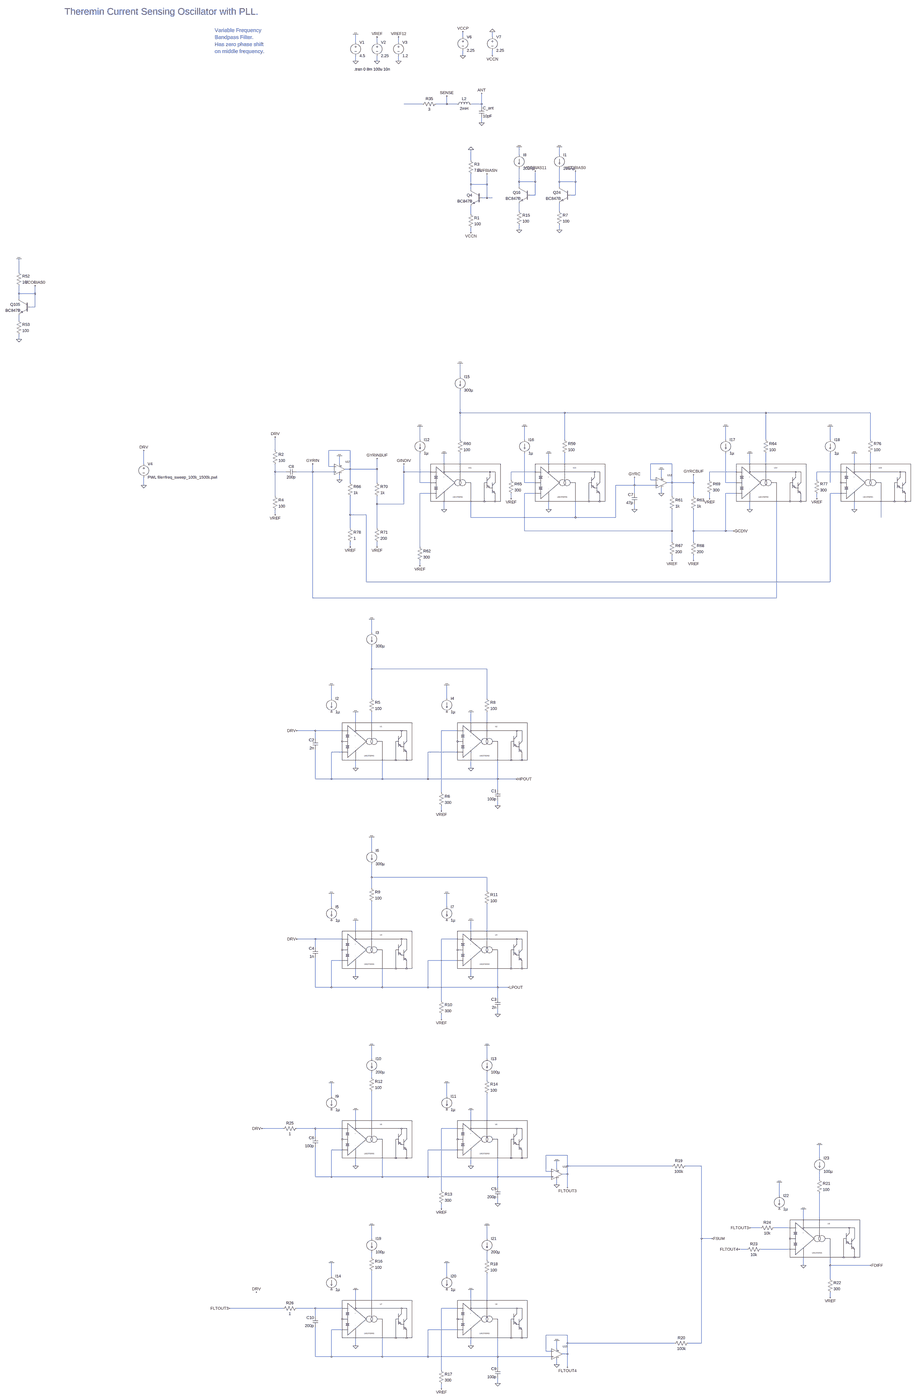
[diagram p0: schematic vco_and_lc_drive_v15.asc, whole sheet]
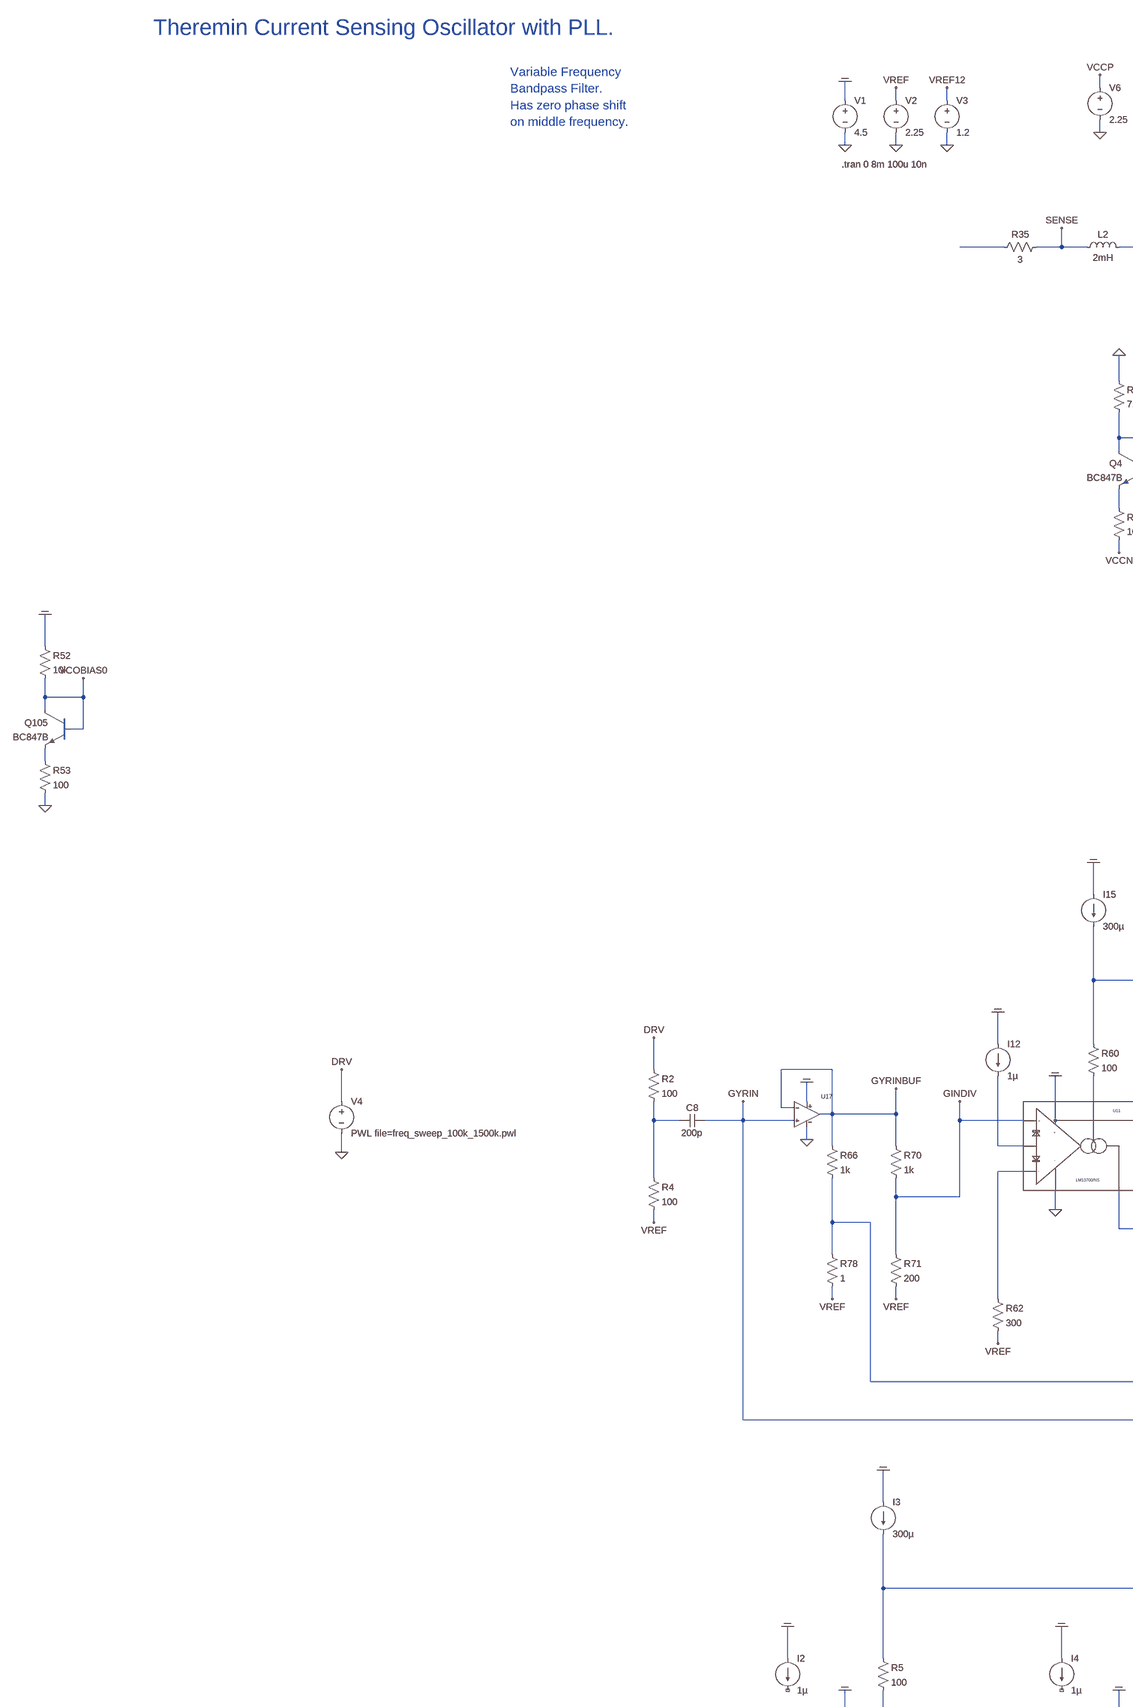
[diagram p1: schematic vco_and_lc_drive_v15.asc, part, row 1 of 2, column 1 of 2]
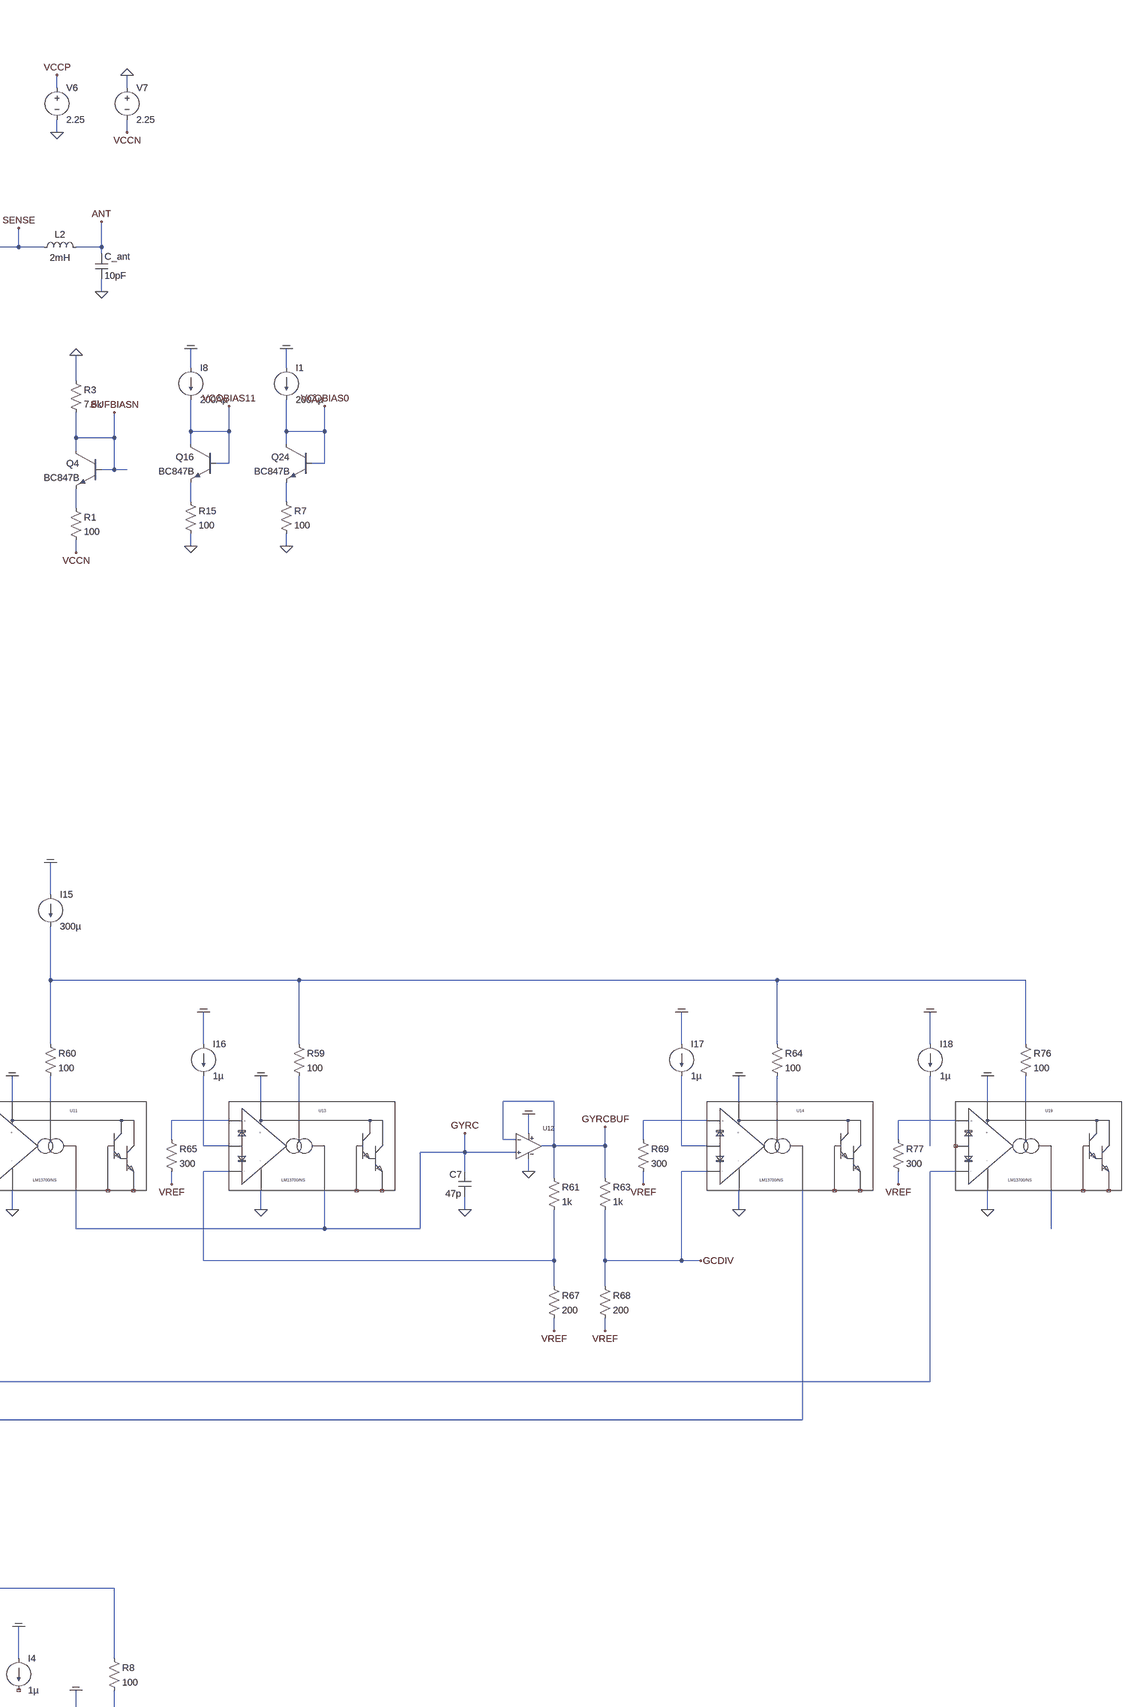
[diagram p2: schematic vco_and_lc_drive_v15.asc, part, row 1 of 2, column 2 of 2]
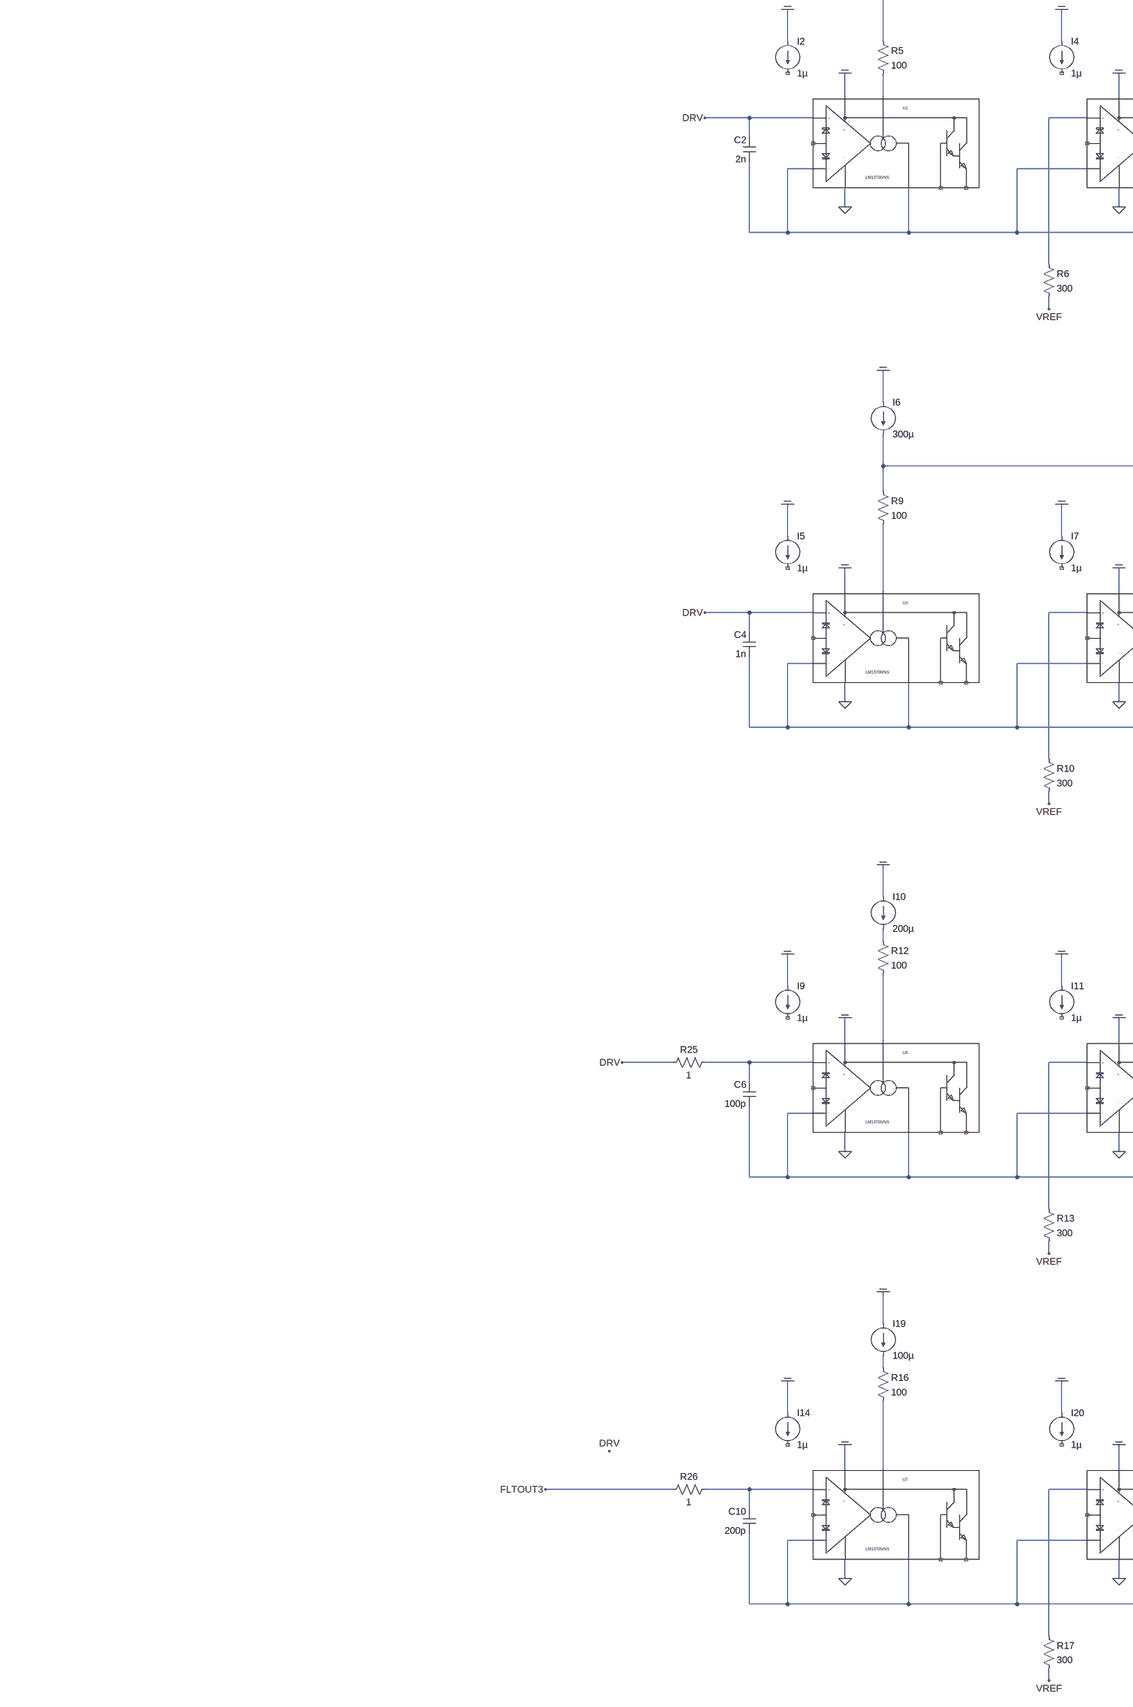
[diagram p3: schematic vco_and_lc_drive_v15.asc, part, row 2 of 2, column 1 of 2]
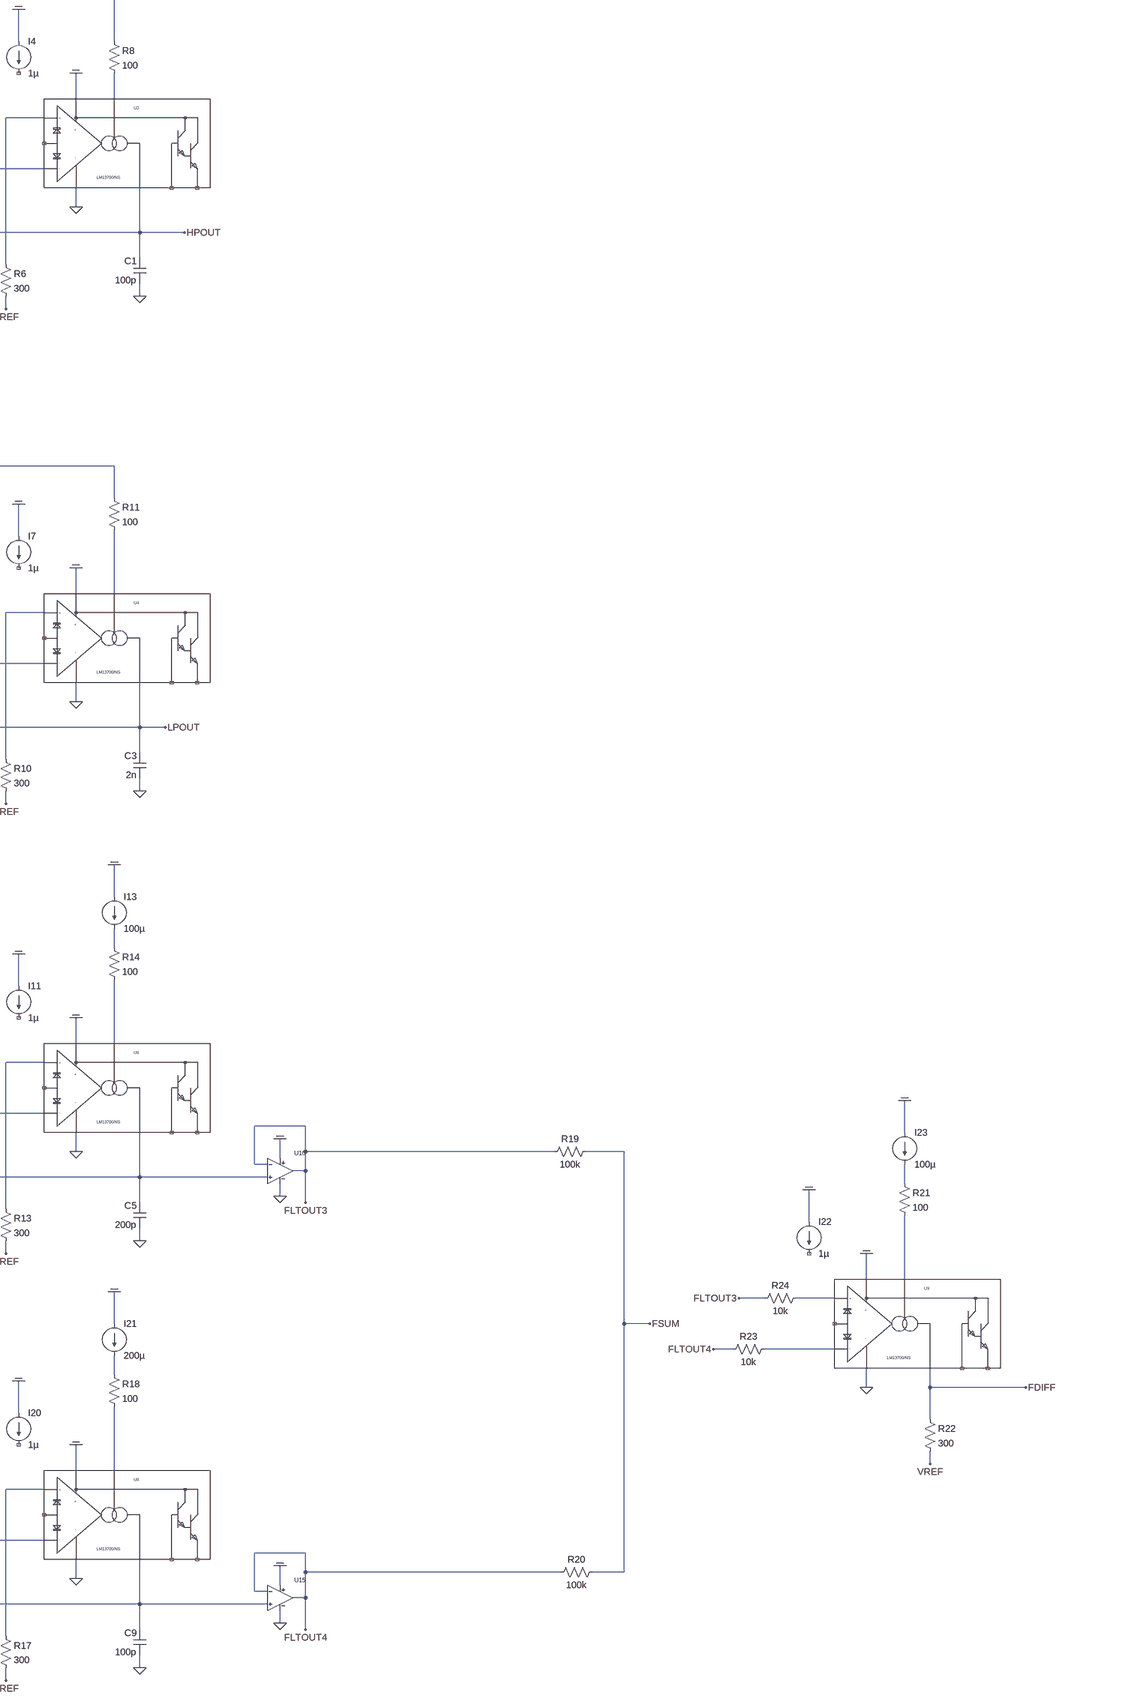
[diagram p4: schematic vco_and_lc_drive_v15.asc, part, row 2 of 2, column 2 of 2]
vco_and_lc_drive_v15.asc, the LTspice schematic file:
Version 4
SHEET 1 13504 29468
WIRE -4960 19040 -4960 19008
WIRE -4784 19040 -4784 19008
WIRE -5600 19072 -5600 19024
WIRE -5472 19072 -5472 19040
WIRE -5344 19072 -5344 19040
WIRE -4960 19152 -4960 19120
WIRE -4784 19152 -4784 19120
WIRE -5600 19184 -5600 19152
WIRE -5472 19184 -5472 19152
WIRE -5344 19184 -5344 19152
WIRE -5200 19440 -5312 19440
WIRE -5056 19440 -5056 19392
WIRE -5056 19440 -5120 19440
WIRE -4992 19440 -5056 19440
WIRE -4848 19440 -4848 19376
WIRE -4848 19440 -4912 19440
WIRE -4848 19456 -4848 19440
WIRE -4848 19552 -4848 19520
WIRE -4624 19856 -4624 19808
WIRE -4384 19856 -4384 19808
WIRE -4912 19888 -4912 19824
WIRE -4624 20016 -4624 19936
WIRE -4528 20016 -4528 19952
WIRE -4528 20016 -4624 20016
WIRE -4384 20016 -4384 19936
WIRE -4288 20016 -4288 19952
WIRE -4288 20016 -4384 20016
WIRE -4912 20032 -4912 19968
WIRE -4816 20032 -4816 19968
WIRE -4816 20032 -4912 20032
WIRE -4624 20048 -4624 20016
WIRE -4384 20048 -4384 20016
WIRE -4912 20064 -4912 20032
WIRE -4528 20096 -4528 20016
WIRE -4528 20096 -4560 20096
WIRE -4288 20096 -4288 20016
WIRE -4288 20096 -4320 20096
WIRE -4816 20112 -4816 20032
WIRE -4816 20112 -4848 20112
WIRE -4784 20112 -4816 20112
WIRE -4624 20192 -4624 20144
WIRE -4384 20192 -4384 20144
WIRE -4912 20208 -4912 20160
WIRE -4624 20304 -4624 20272
WIRE -4384 20304 -4384 20272
WIRE -4912 20320 -4912 20288
WIRE -7904 20928 -7904 20848
WIRE -7904 21056 -7904 21008
WIRE -7808 21056 -7808 21008
WIRE -7808 21056 -7904 21056
WIRE -7904 21088 -7904 21056
WIRE -7808 21136 -7808 21056
WIRE -7808 21136 -7840 21136
WIRE -7904 21216 -7904 21184
WIRE -7904 21328 -7904 21296
WIRE -4976 21632 -4976 21552
WIRE -4976 21872 -4976 21712
WIRE -4352 21872 -4976 21872
WIRE -3152 21872 -4352 21872
WIRE -2528 21872 -3152 21872
WIRE -5216 22032 -5216 21952
WIRE -4976 22032 -4976 21872
WIRE -4592 22032 -4592 21952
WIRE -4352 22032 -4352 21872
WIRE -3392 22032 -3392 21952
WIRE -3152 22032 -3152 21872
WIRE -2768 22032 -2768 21952
WIRE -2528 22032 -2528 21872
WIRE -6080 22096 -6080 22016
WIRE -5632 22096 -5760 22096
WIRE -6864 22176 -6864 22096
WIRE -5696 22176 -5696 22128
WIRE -5072 22176 -5072 22112
WIRE -4976 22176 -4976 22112
WIRE -4448 22176 -4448 22112
WIRE -4352 22176 -4352 22112
WIRE -3712 22176 -3840 22176
WIRE -3248 22176 -3248 22112
WIRE -3152 22176 -3152 22112
WIRE -2624 22176 -2624 22112
WIRE -2528 22176 -2528 22112
WIRE -5760 22192 -5760 22096
WIRE -5728 22192 -5760 22192
WIRE -5632 22208 -5632 22096
WIRE -5632 22208 -5664 22208
WIRE -5472 22208 -5472 22144
WIRE -5472 22208 -5632 22208
WIRE -6080 22224 -6080 22176
WIRE -6016 22224 -6080 22224
WIRE -5856 22224 -5856 22176
WIRE -5856 22224 -5952 22224
WIRE -5728 22224 -5856 22224
WIRE -5312 22224 -5312 22176
WIRE -5152 22224 -5312 22224
WIRE -4528 22224 -4672 22224
WIRE -3328 22224 -3488 22224
WIRE -2704 22224 -2848 22224
WIRE -3776 22256 -3776 22208
WIRE -5696 22272 -5696 22240
WIRE -4672 22272 -4672 22224
WIRE -3840 22272 -3840 22176
WIRE -3808 22272 -3840 22272
WIRE -3488 22272 -3488 22224
WIRE -2848 22272 -2848 22224
WIRE -5632 22288 -5632 22208
WIRE -5472 22288 -5472 22208
WIRE -5216 22288 -5216 22112
WIRE -5152 22288 -5216 22288
WIRE -4592 22288 -4592 22112
WIRE -4528 22288 -4592 22288
WIRE -3712 22288 -3712 22176
WIRE -3712 22288 -3744 22288
WIRE -3584 22288 -3584 22240
WIRE -3584 22288 -3712 22288
WIRE -3392 22288 -3392 22112
WIRE -3328 22288 -3392 22288
WIRE -2768 22288 -2768 22112
WIRE -6864 22304 -6864 22256
WIRE -3936 22304 -3936 22256
WIRE -3936 22304 -4048 22304
WIRE -3808 22304 -3936 22304
WIRE -5152 22352 -5216 22352
WIRE -4528 22352 -4592 22352
WIRE -3936 22352 -3936 22304
WIRE -3776 22352 -3776 22320
WIRE -3328 22352 -3392 22352
WIRE -2704 22352 -2768 22352
WIRE -6080 22368 -6080 22224
WIRE -3712 22368 -3712 22288
WIRE -3584 22368 -3584 22288
WIRE -4672 22384 -4672 22352
WIRE -3488 22384 -3488 22352
WIRE -2848 22384 -2848 22352
WIRE -5472 22416 -5472 22368
WIRE -5312 22416 -5312 22224
WIRE -5312 22416 -5472 22416
WIRE -5072 22448 -5072 22400
WIRE -4448 22448 -4448 22400
WIRE -3936 22448 -3936 22416
WIRE -3248 22448 -3248 22400
WIRE -2624 22448 -2624 22400
WIRE -6080 22480 -6080 22448
WIRE -5632 22480 -5632 22368
WIRE -5536 22480 -5632 22480
WIRE -4912 22496 -4912 22400
WIRE -4288 22496 -4288 22400
WIRE -4288 22496 -4912 22496
WIRE -4048 22496 -4048 22304
WIRE -4048 22496 -4288 22496
WIRE -2464 22496 -2464 22400
WIRE -5632 22560 -5632 22480
WIRE -5472 22560 -5472 22416
WIRE -4592 22576 -4592 22352
WIRE -3712 22576 -3712 22448
WIRE -3712 22576 -4592 22576
WIRE -3584 22576 -3584 22448
WIRE -3392 22576 -3392 22352
WIRE -3392 22576 -3584 22576
WIRE -3344 22576 -3392 22576
WIRE -3712 22640 -3712 22576
WIRE -3584 22640 -3584 22576
WIRE -5632 22672 -5632 22640
WIRE -5472 22672 -5472 22640
WIRE -5216 22672 -5216 22352
WIRE -3712 22752 -3712 22720
WIRE -3584 22752 -3584 22720
WIRE -5216 22784 -5216 22752
WIRE -5536 22880 -5536 22480
WIRE -2768 22880 -2768 22352
WIRE -2768 22880 -5536 22880
WIRE -5856 22976 -5856 22224
WIRE -3088 22976 -3088 22400
WIRE -3088 22976 -5856 22976
WIRE -5504 23888 -5504 23808
WIRE -5504 24112 -5504 23968
WIRE -4816 24112 -5504 24112
WIRE -5744 24288 -5744 24208
WIRE -5504 24288 -5504 24112
WIRE -5056 24288 -5056 24208
WIRE -4816 24288 -4816 24112
WIRE -5600 24432 -5600 24368
WIRE -5504 24432 -5504 24368
WIRE -4912 24432 -4912 24368
WIRE -4816 24432 -4816 24368
WIRE -5840 24480 -5952 24480
WIRE -5680 24480 -5840 24480
WIRE -4992 24480 -5088 24480
WIRE -5840 24528 -5840 24480
WIRE -5680 24608 -5744 24608
WIRE -4992 24608 -5168 24608
WIRE -5600 24704 -5600 24656
WIRE -4912 24704 -4912 24656
WIRE -5840 24768 -5840 24592
WIRE -5744 24768 -5744 24608
WIRE -5744 24768 -5840 24768
WIRE -5440 24768 -5440 24656
WIRE -5440 24768 -5744 24768
WIRE -5168 24768 -5168 24608
WIRE -5168 24768 -5440 24768
WIRE -4752 24768 -4752 24656
WIRE -4752 24768 -5168 24768
WIRE -4640 24768 -4752 24768
WIRE -4752 24832 -4752 24768
WIRE -5088 24848 -5088 24480
WIRE -4752 24928 -4752 24896
WIRE -5088 24960 -5088 24928
WIRE -5504 25200 -5504 25120
WIRE -5504 25360 -5504 25280
WIRE -4816 25360 -5504 25360
WIRE -5504 25424 -5504 25360
WIRE -4816 25440 -4816 25360
WIRE -5744 25536 -5744 25456
WIRE -5056 25536 -5056 25456
WIRE -5600 25680 -5600 25616
WIRE -5504 25680 -5504 25504
WIRE -4912 25680 -4912 25616
WIRE -4816 25680 -4816 25520
WIRE -5840 25728 -5952 25728
WIRE -5680 25728 -5840 25728
WIRE -4992 25728 -5088 25728
WIRE -5840 25776 -5840 25728
WIRE -5680 25856 -5744 25856
WIRE -4992 25856 -5168 25856
WIRE -5600 25952 -5600 25904
WIRE -4912 25952 -4912 25904
WIRE -5840 26016 -5840 25840
WIRE -5744 26016 -5744 25856
WIRE -5744 26016 -5840 26016
WIRE -5440 26016 -5440 25904
WIRE -5440 26016 -5744 26016
WIRE -5168 26016 -5168 25856
WIRE -5168 26016 -5440 26016
WIRE -4752 26016 -4752 25904
WIRE -4752 26016 -5168 26016
WIRE -4688 26016 -4752 26016
WIRE -4752 26080 -4752 26016
WIRE -5088 26096 -5088 25728
WIRE -4752 26176 -4752 26144
WIRE -5088 26208 -5088 26176
WIRE -5504 26624 -5504 26544
WIRE -4816 26624 -4816 26544
WIRE -5504 26736 -5504 26704
WIRE -4816 26752 -4816 26704
WIRE -5744 26848 -5744 26768
WIRE -5056 26848 -5056 26768
WIRE -5600 26992 -5600 26928
WIRE -5504 26992 -5504 26816
WIRE -4912 26992 -4912 26928
WIRE -4816 26992 -4816 26832
WIRE -6032 27040 -6160 27040
WIRE -5840 27040 -5952 27040
WIRE -5680 27040 -5840 27040
WIRE -4992 27040 -5088 27040
WIRE -5840 27088 -5840 27040
WIRE -5680 27168 -5744 27168
WIRE -4992 27168 -5168 27168
WIRE -4336 27200 -4464 27200
WIRE -2832 27216 -2832 27136
WIRE -5600 27264 -5600 27216
WIRE -4912 27264 -4912 27216
WIRE -4336 27264 -4336 27200
WIRE -3712 27264 -4336 27264
WIRE -3536 27264 -3632 27264
WIRE -4400 27280 -4400 27232
WIRE -4464 27296 -4464 27200
WIRE -4432 27296 -4464 27296
WIRE -4336 27312 -4336 27264
WIRE -4336 27312 -4368 27312
WIRE -5840 27328 -5840 27152
WIRE -5744 27328 -5744 27168
WIRE -5744 27328 -5840 27328
WIRE -5440 27328 -5440 27216
WIRE -5440 27328 -5744 27328
WIRE -5168 27328 -5168 27168
WIRE -5168 27328 -5440 27328
WIRE -4752 27328 -4752 27216
WIRE -4752 27328 -5168 27328
WIRE -4432 27328 -4752 27328
WIRE -2832 27344 -2832 27296
WIRE -4400 27376 -4400 27344
WIRE -4752 27392 -4752 27328
WIRE -4336 27392 -4336 27312
WIRE -5088 27408 -5088 27040
WIRE -3072 27440 -3072 27360
WIRE -4752 27488 -4752 27456
WIRE -5088 27520 -5088 27488
WIRE -2928 27584 -2928 27520
WIRE -2832 27584 -2832 27424
WIRE -3184 27632 -3248 27632
WIRE -3008 27632 -3104 27632
WIRE -5504 27696 -5504 27616
WIRE -4816 27696 -4816 27616
WIRE -3536 27696 -3536 27264
WIRE -3472 27696 -3536 27696
WIRE -3264 27760 -3312 27760
WIRE -3008 27760 -3184 27760
WIRE -5504 27808 -5504 27776
WIRE -4816 27824 -4816 27776
WIRE -2928 27856 -2928 27808
WIRE -2768 27856 -2768 27808
WIRE -2528 27856 -2768 27856
WIRE -5744 27920 -5744 27840
WIRE -5056 27920 -5056 27840
WIRE -2768 27936 -2768 27856
WIRE -2768 28048 -2768 28016
WIRE -5600 28064 -5600 28000
WIRE -5504 28064 -5504 27888
WIRE -4912 28064 -4912 28000
WIRE -4816 28064 -4816 27904
WIRE -6032 28112 -6352 28112
WIRE -5840 28112 -5952 28112
WIRE -5680 28112 -5840 28112
WIRE -4992 28112 -5088 28112
WIRE -5840 28160 -5840 28112
WIRE -5680 28240 -5744 28240
WIRE -4992 28240 -5168 28240
WIRE -4336 28272 -4464 28272
WIRE -4336 28320 -4336 28272
WIRE -3696 28320 -4336 28320
WIRE -3536 28320 -3536 27696
WIRE -3536 28320 -3616 28320
WIRE -5600 28336 -5600 28288
WIRE -4912 28336 -4912 28288
WIRE -4400 28352 -4400 28304
WIRE -4464 28368 -4464 28272
WIRE -4432 28368 -4464 28368
WIRE -4336 28384 -4336 28320
WIRE -4336 28384 -4368 28384
WIRE -5840 28400 -5840 28224
WIRE -5744 28400 -5744 28240
WIRE -5744 28400 -5840 28400
WIRE -5440 28400 -5440 28288
WIRE -5440 28400 -5744 28400
WIRE -5168 28400 -5168 28240
WIRE -5168 28400 -5440 28400
WIRE -4752 28400 -4752 28288
WIRE -4752 28400 -5168 28400
WIRE -4432 28400 -4752 28400
WIRE -4400 28448 -4400 28416
WIRE -4752 28464 -4752 28400
WIRE -4336 28464 -4336 28384
WIRE -5088 28480 -5088 28112
WIRE -4752 28560 -4752 28528
WIRE -5088 28592 -5088 28560
FLAG -5600 19184 0
FLAG -5600 19024 COM
FLAG -5472 19184 0
FLAG -5472 19040 VREF
FLAG -4848 19376 ANT
FLAG -5056 19392 SENSE
FLAG -5344 19184 0
FLAG -5344 19040 VREF12
FLAG -7904 20848 COM
FLAG -7904 21328 0
FLAG -7808 21008 VCOBIAS0
FLAG -4960 19152 0
FLAG -4960 19008 VCCP
FLAG -4784 19008 0
FLAG -4784 19152 VCCN
FLAG -4912 20320 VCCN
FLAG -4912 19824 0
FLAG -4816 19968 BUFBIASN
FLAG -4848 19552 0
FLAG -4624 20304 0
FLAG -4528 19952 VCOBIAS11
FLAG -4624 19808 COM
FLAG -4384 20304 0
FLAG -4288 19952 VCOBIAS0
FLAG -4384 19808 COM
FLAG -6864 22304 0
FLAG -6864 22096 DRV
FLAG -5072 22448 0
FLAG -5072 22112 COM
FLAG -5216 21952 COM
FLAG -3936 22448 0
FLAG -3936 22256 GYRC
FLAG -4976 21552 COM
FLAG -5216 22784 VREF
FLAG -3776 22352 0
FLAG -3776 22208 COM
FLAG -4448 22448 0
FLAG -4448 22112 COM
FLAG -4592 21952 COM
FLAG -4672 22384 VREF
FLAG -3712 22752 VREF
FLAG -6080 22016 DRV
FLAG -3248 22448 0
FLAG -3248 22112 COM
FLAG -3392 21952 COM
FLAG -3488 22384 VREF
FLAG -5696 22272 0
FLAG -5696 22128 COM
FLAG -2624 22448 0
FLAG -2624 22112 COM
FLAG -2768 21952 COM
FLAG -2848 22384 VREF
FLAG -5632 22672 VREF
FLAG -3584 22752 VREF
FLAG -5472 22672 VREF
FLAG -5856 22176 GYRIN
FLAG -5472 22144 GYRINBUF
FLAG -3584 22240 GYRCBUF
FLAG -3344 22576 GCDIV
FLAG -5312 22176 GINDIV
FLAG -6080 22480 VREF
FLAG -5600 24704 0
FLAG -5600 24368 COM
FLAG -5744 24208 COM
FLAG -5504 23808 COM
FLAG -5088 24960 VREF
FLAG -5952 24480 DRV
FLAG -4912 24704 0
FLAG -4912 24368 COM
FLAG -5056 24208 COM
FLAG -4752 24928 0
FLAG -5600 25952 0
FLAG -5600 25616 COM
FLAG -5744 25456 COM
FLAG -5504 25120 COM
FLAG -5088 26208 VREF
FLAG -5952 25728 DRV
FLAG -4912 25952 0
FLAG -4912 25616 COM
FLAG -5056 25456 COM
FLAG -4752 26176 0
FLAG -4688 26016 LPOUT
FLAG -4640 24768 HPOUT
FLAG -5600 27264 0
FLAG -5600 26928 COM
FLAG -5744 26768 COM
FLAG -5504 26544 COM
FLAG -5088 27520 VREF
FLAG -6160 27040 DRV
FLAG -4912 27264 0
FLAG -4912 26928 COM
FLAG -5056 26768 COM
FLAG -4752 27488 0
FLAG -4336 27392 FLTOUT3
FLAG -4816 26544 COM
FLAG -5600 28336 0
FLAG -5600 28000 COM
FLAG -5744 27840 COM
FLAG -5504 27616 COM
FLAG -5088 28592 VREF
FLAG -6192 28016 DRV
FLAG -4912 28336 0
FLAG -4912 28000 COM
FLAG -5056 27840 COM
FLAG -4752 28560 0
FLAG -4336 28464 FLTOUT4
FLAG -4816 27616 COM
FLAG -3472 27696 FSUM
FLAG -2928 27856 0
FLAG -2928 27520 COM
FLAG -3072 27360 COM
FLAG -2832 27136 COM
FLAG -2768 28048 VREF
FLAG -3312 27760 FLTOUT4
FLAG -3248 27632 FLTOUT3
FLAG -2528 27856 FDIFF
FLAG -4400 27376 0
FLAG -4400 27232 COM
FLAG -4400 28448 0
FLAG -4400 28304 COM
FLAG -6352 28112 FLTOUT3
SYMBOL voltage -5600 19056 R0
SYMATTR InstName V1
SYMATTR Value 4.5
SYMBOL Voltage -5472 19056 R0
SYMATTR InstName V2
SYMATTR Value 2.25
SYMBOL ind -5008 19456 R270
WINDOW 0 32 56 VTop 2
WINDOW 3 5 56 VBottom 2
SYMATTR InstName L2
SYMATTR Value 2mH
SYMATTR SpiceLine Rser=120 Cpar=1pF
SYMBOL Cap -4864 19456 R0
SYMATTR InstName C_ant
SYMATTR Value 10pF
SYMBOL Res -5216 19456 R270
WINDOW 0 32 56 VTop 2
WINDOW 3 0 56 VBottom 2
SYMATTR InstName R35
SYMATTR Value 3
SYMBOL Voltage -5344 19056 R0
SYMATTR InstName V3
SYMATTR Value 1.2
SYMBOL npn -7840 21088 M0
SYMATTR InstName Q105
SYMATTR Value BC847B
SYMBOL Res -7920 20912 R0
SYMATTR InstName R52
SYMATTR Value 10k
SYMBOL Res -7920 21200 R0
SYMATTR InstName R53
SYMATTR Value 100
SYMBOL Voltage -4960 19024 R0
SYMATTR InstName V6
SYMATTR Value 2.25
SYMBOL Voltage -4784 19024 R0
SYMATTR InstName V7
SYMATTR Value 2.25
SYMBOL npn -4848 20064 M0
SYMATTR InstName Q4
SYMATTR Value BC847B
SYMBOL Res -4928 20192 R0
SYMATTR InstName R1
SYMATTR Value 100
SYMBOL Res -4928 19872 R0
SYMATTR InstName R3
SYMATTR Value 7.5k
SYMBOL npn -4560 20048 M0
SYMATTR InstName Q16
SYMATTR Value BC847B
SYMBOL Res -4640 20176 R0
SYMATTR InstName R15
SYMATTR Value 100
SYMBOL current -4624 19856 R0
SYMATTR InstName I8
SYMATTR Value 200Âµ
SYMBOL npn -4320 20048 M0
SYMATTR InstName Q24
SYMATTR Value BC847B
SYMBOL Res -4400 20176 R0
SYMATTR InstName R7
SYMATTR Value 100
SYMBOL current -4384 19856 R0
SYMATTR InstName I1
SYMATTR Value 200Âµ
SYMBOL Voltage -6864 22160 R0
SYMATTR InstName V4
SYMATTR Value PWL file=freq_sweep_100k_1500k.pwl
SYMBOL LM13700 -5072 22288 R0
SYMATTR InstName U11
SYMBOL current -5216 22032 R0
SYMATTR InstName I12
SYMATTR Value 1µ
SYMBOL Cap -3920 22416 R180
WINDOW 0 24 56 Left 2
WINDOW 3 24 8 Left 2
SYMATTR InstName C7
SYMATTR Value 47p
SYMBOL Res -4992 22016 R0
SYMATTR InstName R60
SYMATTR Value 100
SYMBOL Res -3728 22352 R0
SYMATTR InstName R61
SYMATTR Value 1k
SYMBOL current -4976 21632 R0
SYMATTR InstName I15
SYMATTR Value 300µ
SYMBOL Res -5232 22656 R0
SYMATTR InstName R62
SYMATTR Value 300
SYMBOL MCP6021 -3776 22288 R0
SYMATTR InstName U12
SYMBOL LM13700 -4448 22288 R0
SYMATTR InstName U13
SYMBOL current -4592 22032 R0
SYMATTR InstName I16
SYMATTR Value 1µ
SYMBOL Res -4368 22016 R0
SYMATTR InstName R59
SYMATTR Value 100
SYMBOL Res -4688 22256 R0
SYMATTR InstName R65
SYMATTR Value 300
SYMBOL Res -3728 22624 R0
SYMATTR InstName R67
SYMATTR Value 200
SYMBOL LM13700 -3248 22288 R0
SYMATTR InstName U14
SYMBOL current -3392 22032 R0
SYMATTR InstName I17
SYMATTR Value 1µ
SYMBOL Res -3168 22016 R0
SYMATTR InstName R64
SYMATTR Value 100
SYMBOL Res -5648 22272 R0
SYMATTR InstName R66
SYMATTR Value 1k
SYMBOL Res -3504 22256 R0
SYMATTR InstName R69
SYMATTR Value 300
SYMBOL MCP6021 -5696 22208 R0
SYMATTR InstName U17
SYMBOL LM13700 -2624 22288 R0
SYMATTR InstName U19
SYMBOL current -2768 22032 R0
SYMATTR InstName I18
SYMATTR Value 1µ
SYMBOL Res -2544 22016 R0
SYMATTR InstName R76
SYMATTR Value 100
SYMBOL Res -2864 22256 R0
SYMATTR InstName R77
SYMATTR Value 300
SYMBOL Res -5648 22544 R0
SYMATTR InstName R78
SYMATTR Value 1
SYMBOL Res -3600 22352 R0
SYMATTR InstName R63
SYMATTR Value 1k
SYMBOL Res -3600 22624 R0
SYMATTR InstName R68
SYMATTR Value 200
SYMBOL Res -5488 22272 R0
SYMATTR InstName R70
SYMATTR Value 1k
SYMBOL Res -5488 22544 R0
SYMATTR InstName R71
SYMATTR Value 200
SYMBOL Cap -5952 22208 R90
WINDOW 0 0 32 VBottom 2
WINDOW 3 32 32 VTop 2
SYMATTR InstName C8
SYMATTR Value 200p
SYMBOL Res -6096 22080 R0
SYMATTR InstName R2
SYMATTR Value 100
SYMBOL Res -6096 22352 R0
SYMATTR InstName R4
SYMATTR Value 100
SYMBOL LM13700 -5600 24544 R0
SYMATTR InstName U1
SYMBOL current -5744 24288 R0
SYMATTR InstName I2
SYMATTR Value 1µ
SYMBOL Res -5520 24272 R0
SYMATTR InstName R5
SYMATTR Value 100
SYMBOL current -5504 23888 R0
SYMATTR InstName I3
SYMATTR Value 300µ
SYMBOL Res -5104 24832 R0
SYMATTR InstName R6
SYMATTR Value 300
SYMBOL LM13700 -4912 24544 R0
SYMATTR InstName U2
SYMBOL current -5056 24288 R0
SYMATTR InstName I4
SYMATTR Value 1µ
SYMBOL Res -4832 24272 R0
SYMATTR InstName R8
SYMATTR Value 100
SYMBOL Cap -4736 24896 R180
WINDOW 0 24 56 Left 2
WINDOW 3 24 8 Left 2
SYMATTR InstName C1
SYMATTR Value 100p
SYMBOL Cap -5824 24592 R180
WINDOW 0 24 56 Left 2
WINDOW 3 24 8 Left 2
SYMATTR InstName C2
SYMATTR Value 2n
SYMBOL LM13700 -5600 25792 R0
SYMATTR InstName U3
SYMBOL current -5744 25536 R0
SYMATTR InstName I5
SYMATTR Value 1µ
SYMBOL Res -5520 25408 R0
SYMATTR InstName R9
SYMATTR Value 100
SYMBOL current -5504 25200 R0
SYMATTR InstName I6
SYMATTR Value 300µ
SYMBOL Res -5104 26080 R0
SYMATTR InstName R10
SYMATTR Value 300
SYMBOL LM13700 -4912 25792 R0
SYMATTR InstName U4
SYMBOL current -5056 25536 R0
SYMATTR InstName I7
SYMATTR Value 1µ
SYMBOL Res -4832 25424 R0
SYMATTR InstName R11
SYMATTR Value 100
SYMBOL Cap -4736 26144 R180
WINDOW 0 24 56 Left 2
WINDOW 3 24 8 Left 2
SYMATTR InstName C3
SYMATTR Value 2n
SYMBOL Cap -5824 25840 R180
WINDOW 0 24 56 Left 2
WINDOW 3 24 8 Left 2
SYMATTR InstName C4
SYMATTR Value 1n
SYMBOL LM13700 -5600 27104 R0
SYMATTR InstName U5
SYMBOL current -5744 26848 R0
SYMATTR InstName I9
SYMATTR Value 1µ
SYMBOL Res -5520 26720 R0
SYMATTR InstName R12
SYMATTR Value 100
SYMBOL current -5504 26624 R0
SYMATTR InstName I10
SYMATTR Value 200µ
SYMBOL Res -5104 27392 R0
SYMATTR InstName R13
SYMATTR Value 300
SYMBOL LM13700 -4912 27104 R0
SYMATTR InstName U6
SYMBOL current -5056 26848 R0
SYMATTR InstName I11
SYMATTR Value 1µ
SYMBOL Res -4832 26736 R0
SYMATTR InstName R14
SYMATTR Value 100
SYMBOL Cap -4736 27456 R180
WINDOW 0 24 56 Left 2
WINDOW 3 24 8 Left 2
SYMATTR InstName C5
SYMATTR Value 200p
SYMBOL Cap -5824 27152 R180
WINDOW 0 24 56 Left 2
WINDOW 3 24 8 Left 2
SYMATTR InstName C6
SYMATTR Value 100p
SYMBOL current -4816 26624 R0
SYMATTR InstName I13
SYMATTR Value 100µ
SYMBOL LM13700 -5600 28176 R0
SYMATTR InstName U7
SYMBOL current -5744 27920 R0
SYMATTR InstName I14
SYMATTR Value 1µ
SYMBOL Res -5520 27792 R0
SYMATTR InstName R16
SYMATTR Value 100
SYMBOL current -5504 27696 R0
SYMATTR InstName I19
SYMATTR Value 100µ
SYMBOL Res -5104 28464 R0
SYMATTR InstName R17
SYMATTR Value 300
SYMBOL LM13700 -4912 28176 R0
SYMATTR InstName U8
SYMBOL current -5056 27920 R0
SYMATTR InstName I20
SYMATTR Value 1µ
SYMBOL Res -4832 27808 R0
SYMATTR InstName R18
SYMATTR Value 100
SYMBOL Cap -4736 28528 R180
WINDOW 0 24 56 Left 2
WINDOW 3 24 8 Left 2
SYMATTR InstName C9
SYMATTR Value 100p
SYMBOL Cap -5824 28224 R180
WINDOW 0 24 56 Left 2
WINDOW 3 24 8 Left 2
SYMATTR InstName C10
SYMATTR Value 200p
SYMBOL current -4816 27696 R0
SYMATTR InstName I21
SYMATTR Value 200µ
SYMBOL Res -3616 27248 R90
WINDOW 0 0 56 VBottom 2
WINDOW 3 32 56 VTop 2
SYMATTR InstName R19
SYMATTR Value 100k
SYMBOL Res -3600 28304 R90
WINDOW 0 0 56 VBottom 2
WINDOW 3 32 56 VTop 2
SYMATTR InstName R20
SYMATTR Value 100k
SYMBOL LM13700 -2928 27696 R0
SYMATTR InstName U9
SYMBOL current -3072 27440 R0
SYMATTR InstName I22
SYMATTR Value 1µ
SYMBOL Res -2848 27328 R0
SYMATTR InstName R21
SYMATTR Value 100
SYMBOL current -2832 27216 R0
SYMATTR InstName I23
SYMATTR Value 100µ
SYMBOL Res -2784 27920 R0
SYMATTR InstName R22
SYMATTR Value 300
SYMBOL Res -3168 27744 R90
WINDOW 0 0 56 VBottom 2
WINDOW 3 32 56 VTop 2
SYMATTR InstName R23
SYMATTR Value 10k
SYMBOL Res -3088 27616 R90
WINDOW 0 0 56 VBottom 2
WINDOW 3 32 56 VTop 2
SYMATTR InstName R24
SYMATTR Value 10k
SYMBOL MCP6021 -4400 27312 R0
SYMATTR InstName U10
SYMBOL MCP6021 -4400 28384 R0
SYMATTR InstName U15
SYMBOL Res -5936 27024 R90
WINDOW 0 0 56 VBottom 2
WINDOW 3 32 56 VTop 2
SYMATTR InstName R25
SYMATTR Value 1
SYMBOL Res -5936 28096 R90
WINDOW 0 0 56 VBottom 2
WINDOW 3 32 56 VTop 2
SYMATTR InstName R26
SYMATTR Value 1
TEXT -5608 19232 Left 2 !.tran 0 8m 100u 10n
TEXT -7336 18888 Left 5 ;Theremin Current Sensing Oscillator with PLL.
TEXT -6440 19000 Left 3 ;Variable Frequency \nBandpass Filter.\nHas zero phase shift \non middle frequency.

The netlist it stands for:
* vco_and_lc_drive_v15.asc
V1 COM 0 4.5
V2 VREF 0 2.25
L2 SENSE ANT 2mH Rser=120 Cpar=1pF
C_ant ANT 0 10pF
R35 N001 SENSE 3
V3 VREF12 0 1.2
Q105 VCOBIAS0 VCOBIAS0 N005 0 BC847B
R52 COM VCOBIAS0 10k
R53 N005 0 100
V6 VCCP 0 2.25
V7 0 VCCN 2.25
Q4 BUFBIASN BUFBIASN N004 0 BC847B
R1 N004 VCCN 100
R3 0 BUFBIASN 7.5k
Q16 VCOBIAS11 VCOBIAS11 N002 0 BC847B
R15 N002 0 100
I8 COM VCOBIAS11 200Âµ
Q24 VCOBIAS0 VCOBIAS0 N003 0 BC847B
R7 N003 0 100
I1 COM VCOBIAS0 200Âµ
V4 DRV 0 PWL file=freq_sweep_100k_1500k.pwl
XU11 N007 N015 GINDIV N019 GYRC 0 NC_01 NC_02 COM LM13700/NS  ; pins Ibias Dio_bias in+ in- out V- buf_in buf_out V+
I12 COM N015 1µ
C7 0 GYRC 47p
R60 N006 N007 100
R61 GYRCBUF N020 1k
I15 COM N006 300µ
R62 N019 VREF 300
XU12 GYRC GYRCBUF COM 0 GYRCBUF MCP6021  ; pins In+ In- V+ V- OUT
XU13 N008 N016 N012 N020 GYRC 0 NC_03 NC_04 COM LM13700/NS  ; pins Ibias Dio_bias in+ in- out V- buf_in buf_out V+
I16 COM N016 1µ
R59 N006 N008 100
R65 N012 VREF 300
R67 N020 VREF 200
XU14 N009 N017 N013 GCDIV GYRIN 0 NC_05 NC_06 COM LM13700/NS  ; pins Ibias Dio_bias in+ in- out V- buf_in buf_out V+
I17 COM N017 1µ
R64 N006 N009 100
R66 GYRINBUF N021 1k
R69 N013 VREF 300
XU17 GYRIN GYRINBUF COM 0 GYRINBUF MCP6021  ; pins In+ In- V+ V- OUT
XU19 N010 NC_07 N014 N021 N022 0 NC_08 NC_09 COM LM13700/NS  ; pins Ibias Dio_bias in+ in- out V- buf_in buf_out V+
I18 COM N018 1µ
R76 N006 N010 100
R77 N014 VREF 300
R78 N021 VREF 1
R63 GYRCBUF GCDIV 1k
R68 GCDIV VREF 200
R70 GYRINBUF GINDIV 1k
R71 GINDIV VREF 200
C8 GYRIN N011 200p
R2 DRV N011 100
R4 N011 VREF 100
XU1 N024 NC_10 DRV HPOUT HPOUT 0 NC_11 NC_12 COM LM13700/NS  ; pins Ibias Dio_bias in+ in- out V- buf_in buf_out V+
I2 COM NC_13 1µ
R5 N023 N024 100
I3 COM N023 300µ
R6 N026 VREF 300
XU2 N025 NC_14 N026 HPOUT HPOUT 0 NC_15 NC_16 COM LM13700/NS  ; pins Ibias Dio_bias in+ in- out V- buf_in buf_out V+
I4 COM NC_17 1µ
R8 N023 N025 100
C1 0 HPOUT 100p
C2 HPOUT DRV 2n
XU3 N028 NC_18 DRV LPOUT LPOUT 0 NC_19 NC_20 COM LM13700/NS  ; pins Ibias Dio_bias in+ in- out V- buf_in buf_out V+
I5 COM NC_21 1µ
R9 N027 N028 100
I6 COM N027 300µ
R10 N030 VREF 300
XU4 N029 NC_22 N030 LPOUT LPOUT 0 NC_23 NC_24 COM LM13700/NS  ; pins Ibias Dio_bias in+ in- out V- buf_in buf_out V+
I7 COM NC_25 1µ
R11 N027 N029 100
C3 0 LPOUT 2n
C4 LPOUT DRV 1n
XU5 N033 NC_26 N035 N037 N037 0 NC_27 NC_28 COM LM13700/NS  ; pins Ibias Dio_bias in+ in- out V- buf_in buf_out V+
I9 COM NC_29 1µ
R12 N031 N033 100
I10 COM N031 200µ
R13 N036 VREF 300
XU6 N034 NC_30 N036 N037 N037 0 NC_31 NC_32 COM LM13700/NS  ; pins Ibias Dio_bias in+ in- out V- buf_in buf_out V+
I11 COM NC_33 1µ
R14 N032 N034 100
C5 0 N037 200p
C6 N037 N035 100p
I13 COM N032 100µ
XU7 N044 NC_34 N046 N048 N048 0 NC_35 NC_36 COM LM13700/NS  ; pins Ibias Dio_bias in+ in- out V- buf_in buf_out V+
I14 COM NC_37 1µ
R16 N042 N044 100
I19 COM N042 100µ
R17 N047 VREF 300
XU8 N045 NC_38 N047 N048 N048 0 NC_39 NC_40 COM LM13700/NS  ; pins Ibias Dio_bias in+ in- out V- buf_in buf_out V+
I20 COM NC_41 1µ
R18 N043 N045 100
C9 0 N048 100p
C10 N048 N046 200p
I21 COM N043 200µ
R19 FSUM FLTOUT3 100k
R20 FSUM FLTOUT4 100k
XU9 N039 NC_42 N040 N041 FDIFF 0 NC_43 NC_44 COM LM13700/NS  ; pins Ibias Dio_bias in+ in- out V- buf_in buf_out V+
I22 COM NC_45 1µ
R21 N038 N039 100
I23 COM N038 100µ
R22 FDIFF VREF 300
R23 N041 FLTOUT4 10k
R24 N040 FLTOUT3 10k
XU10 N037 FLTOUT3 COM 0 FLTOUT3 MCP6021  ; pins In+ In- V+ V- OUT
XU15 N048 FLTOUT4 COM 0 FLTOUT4 MCP6021  ; pins In+ In- V+ V- OUT
R25 N035 DRV 1
R26 N046 FLTOUT3 1
.model NPN NPN
.model PNP PNP
.lib standard.bjt
.tran 0 8m 100u 10n
* Theremin Current Sensing Oscillator with PLL.
* Variable Frequency
* Bandpass Filter.
* Has zero phase shift
* on middle frequency.
.lib ns_models.lib
.lib MCP6021.cir
.backanno
.end